# EAGLE design mp3silkscreen (EAGLE 9.5.2)
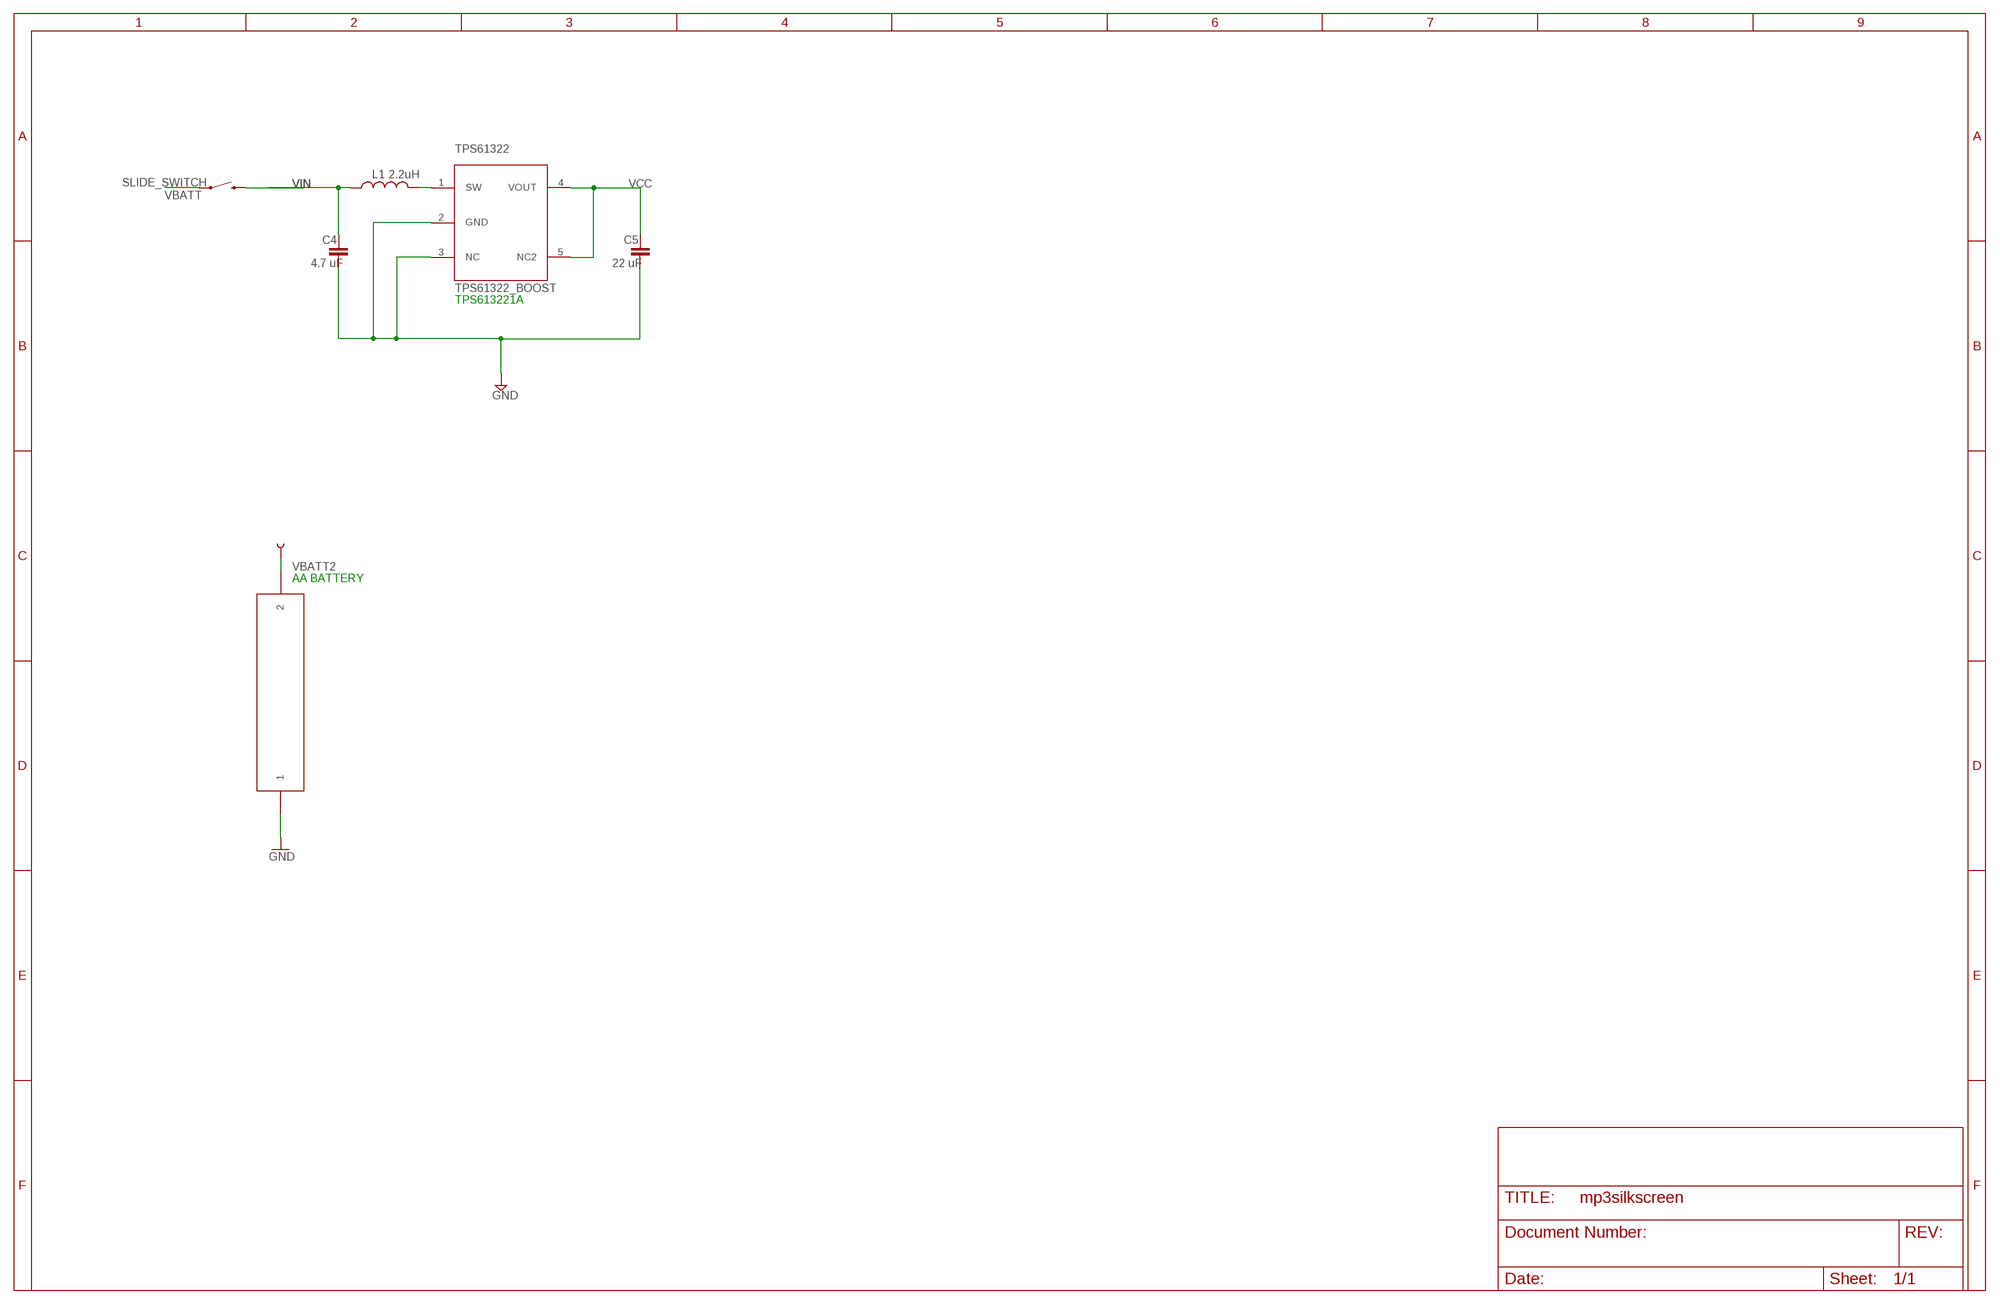
[diagram p0: schematic, sheet 1]

## Parts
C4  4.7 uF  CAPACITOR_0603_L  [RESC0603_L]
C5  22 uF  CAPACITOR_0603_L  [RESC0603_L]
L1  2.2uH  INDUCTOR_0805_L  [RESC0805_L]
TPS61322  TPS61322_BOOST  [SOT23-5L]
U$7  SLIDE_SWITCH  [SLIDE_SWITCH]
U$13  AA_BATT_HOLDER  [AA_BATT_HOLDER]
U$15  TEST_POINT  [TEST_POINT_LARGE]

## Nets
GND: C4.2 C5.2 TPS61322.2(GND) TPS61322.3(NC) U$13.P$1
N$11: L1.2 TPS61322.1(SW)
VBATT: U$7.P$1 U$7.P$2
VBATT2: U$13.P$2 U$15.P$1
VCC: C5.1 TPS61322.4(VOUT) TPS61322.5(NC2)
VIN: C4.1 L1.1 U$7.P$3

## Notes on the sheet
- TPS613221A
- AA BATTERY

## Library data of the parts
C4 C5 = Nordic_nRF:CAPACITOR: Generic chip capacitor
L1 = Nordic_nRF:INDUCTOR: Generic chip inductor
TPS61322 = SophiEaglev9:TPS61322_BOOST
U$7 = SophiEaglev8:SLIDE_SWITCH
U$13 = SophiEaglev9:AA_BATT_HOLDER
U$15 = SophiEaglev9:TEST_POINT

## Board
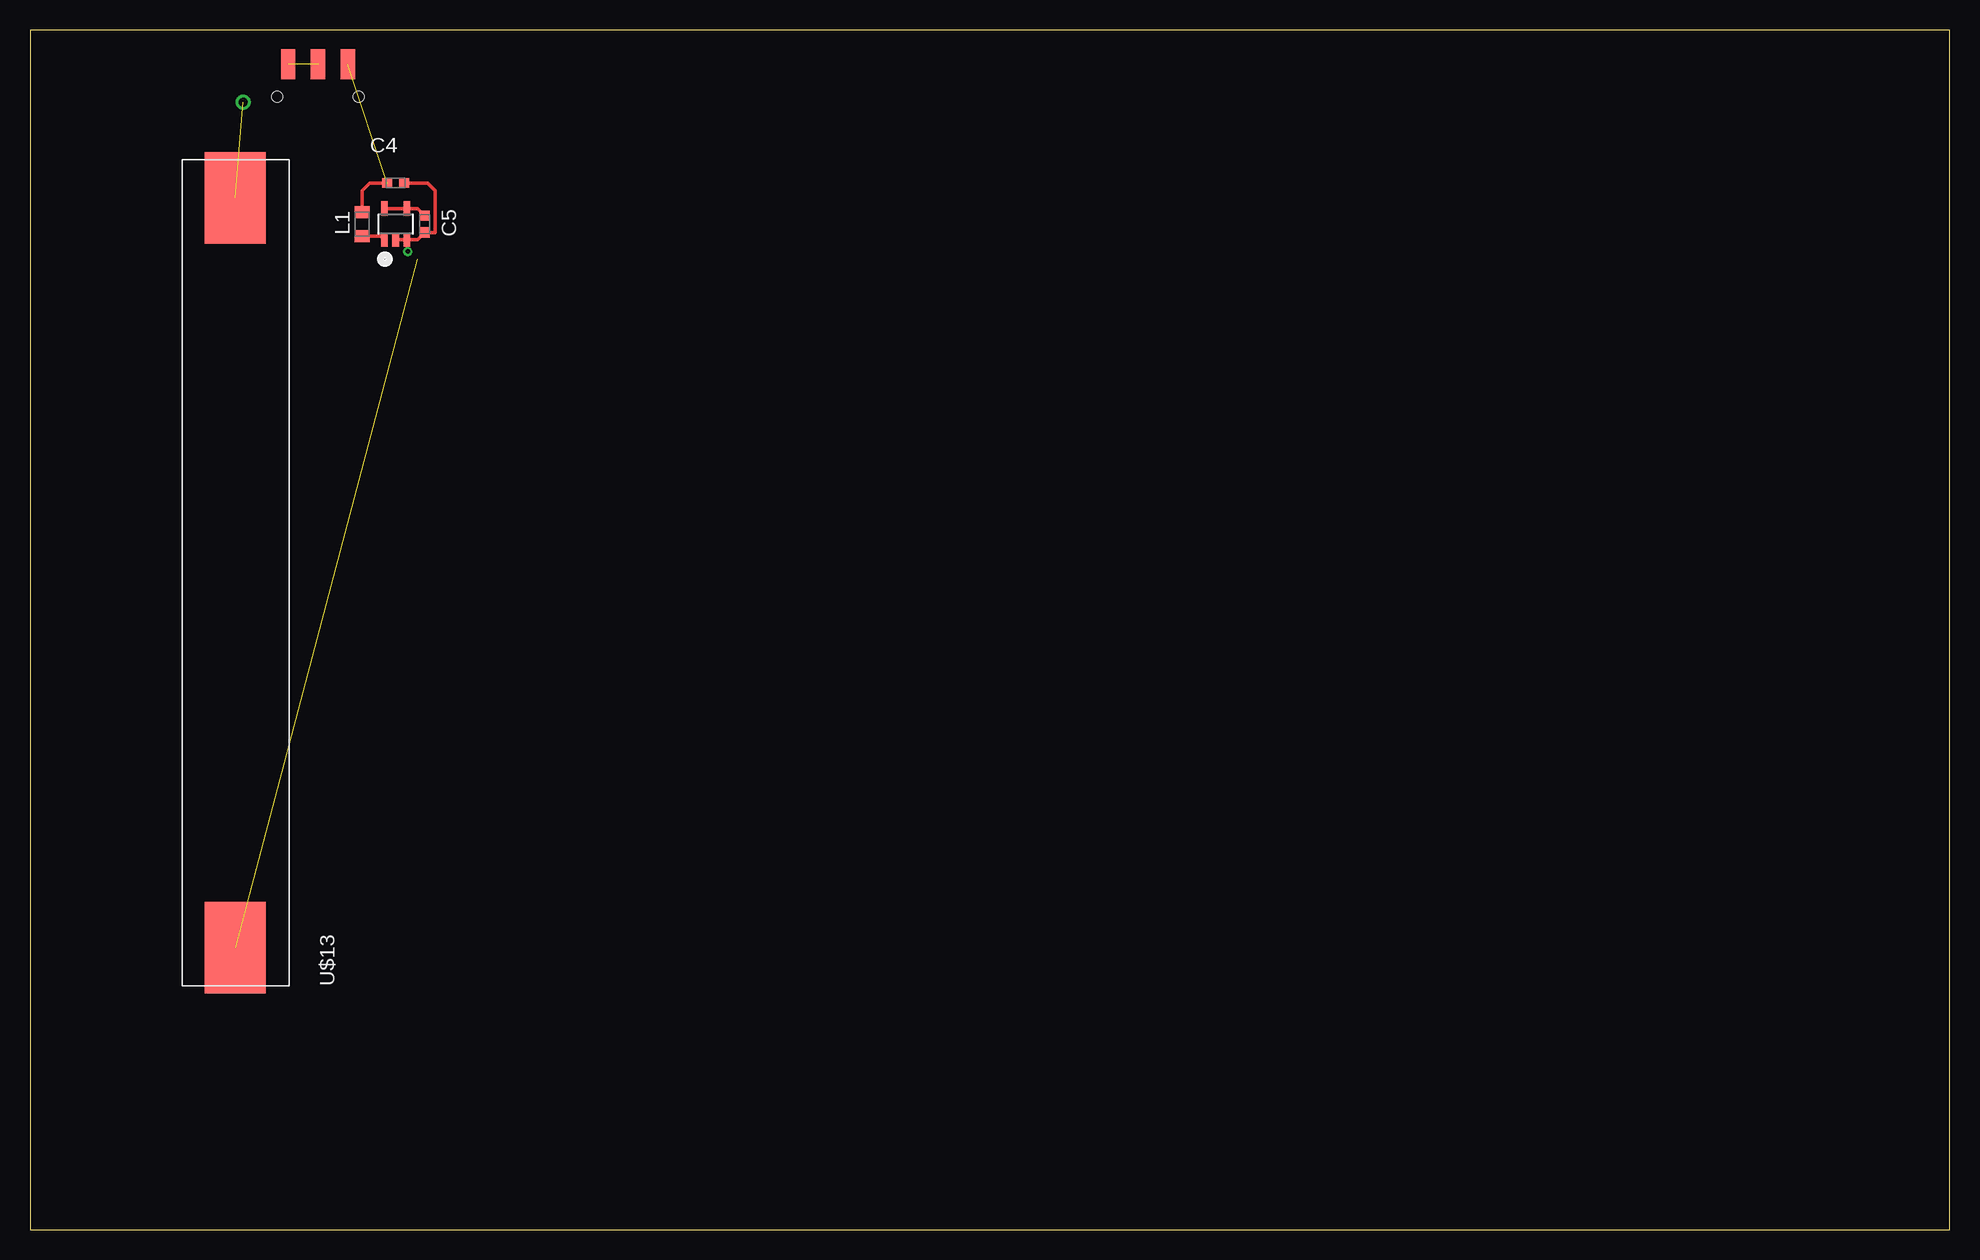
[diagram p1: board, top side]
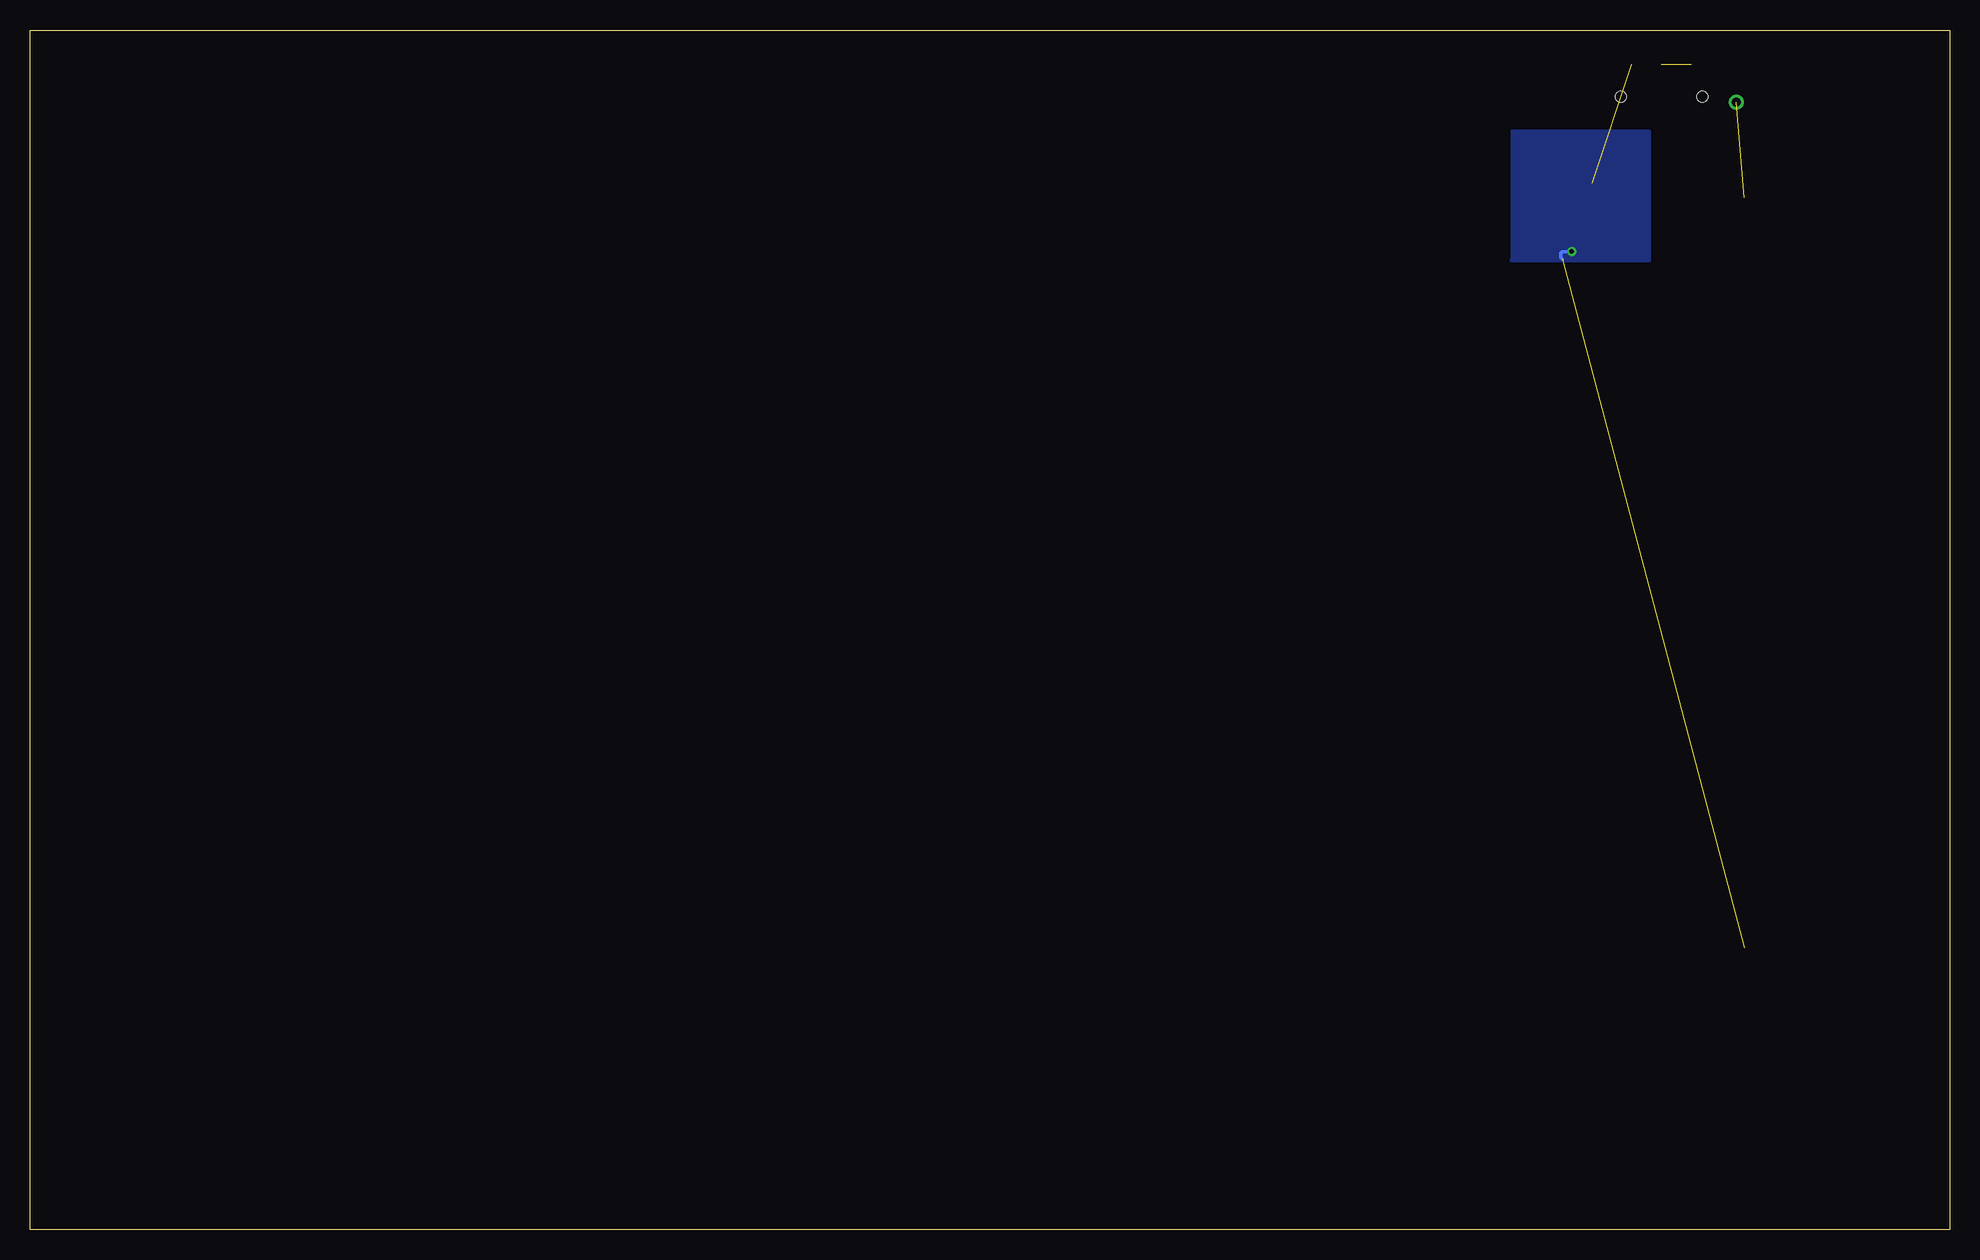
[diagram p2: board, bottom side, seen from below]

Size 160 x 100 mm. Coordinates in mm from the lower left corner, seen from the top.
Outline: 0,0 160,0 160,100 0,100 0,0
Copper layers (1*16): Top 0.035mm / dielectric 1.5mm / Bottom 0.035mm
Design rules "default": minimum track width 6mil, minimum drill 0.35mm, track to track 6mil, track to pad 6mil, pad to pad 6mil, via to via 6mil, smd to smd 6mil, copper to edge 40mil, drill to drill 6mil, minimum pad ring 10mil, minimum via ring 8mil, stop-mask expansion 4mil, vias tented up to drill 0mil, thermal gap 10mil

### Footprints (pad centres in the part's own frame; a part is rotated, then mirrored left to right if it is on the bottom)
RESC0603_L = smd 0.85 x 0.8: 1 -0.7,0; 2 0.7,0
RESC0805_L = smd 1 x 1.25: 1 -1,0; 2 1,0
SOT23-5L = smd 0.55 x 1.2: 1 -0.95,-1.3; 2 0,-1.3; 3 0.95,-1.3; 4 0.95,1.3; 5 -0.95,1.3
SLIDE_SWITCH = smd 1.194 x 2.515: P$1 -2.489,0; P$2 0,0; P$3 2.489,0 | hole 0.889: 3.391,-2.731; -3.391,-2.731
AA_BATT_HOLDER = smd 7.62 x 5.08: P$1 3.175,4.47; P$2 65.684,4.47
TEST_POINT_LARGE = drill 0.75: P$1 1.27,1.27

### Placement (x,y rotation side)
C4  30.48,87.25 0 top
C5  32.89,83.82 270 top
L1  27.69,83.82 270 top
TPS61322  30.48,83.82 0 top
U$7  24,97.16 0 top
U$13  21.59,20.32 90 top
U$15  16.51,92.71 0 top

### Tracks (layer width: path | path; a pad name or v marks a point on that pad's centre or on a via)
GND  (via drill 0.35)  (1 unrouted)
  Top 0.305: TPS61322.2 TPS61322.3 | TPS61322.3 32.29,82.52 C5.2 33.78,83.12 33.78,86.61 33.15,87.25 C4.2 | TPS61322.3 31.43,81.6 v31.5,81.53
  Bottom 0.305: v31.5,81.53 32.26,81.53 32.38,81.41 32.38,81.03 32.26,80.9
  pour Bottom: 25.15,91.57 36.45,91.57 36.45,80.9 36.58,80.77 25.02,80.77 25.02,91.57
N$11
  Top 0.305: L1.2 29.23,82.82 TPS61322.1
VBATT  (1 unrouted)
VBATT2  (1 unrouted)
VCC
  Top 0.305: C5.1 32.29,85.12 TPS61322.4 TPS61322.5
VIN  (1 unrouted)
  Top 0.305: L1.1 27.69,86.61 28.32,87.25 C4.1